# EAGLE design 6x7 (EAGLE 6.6.0)
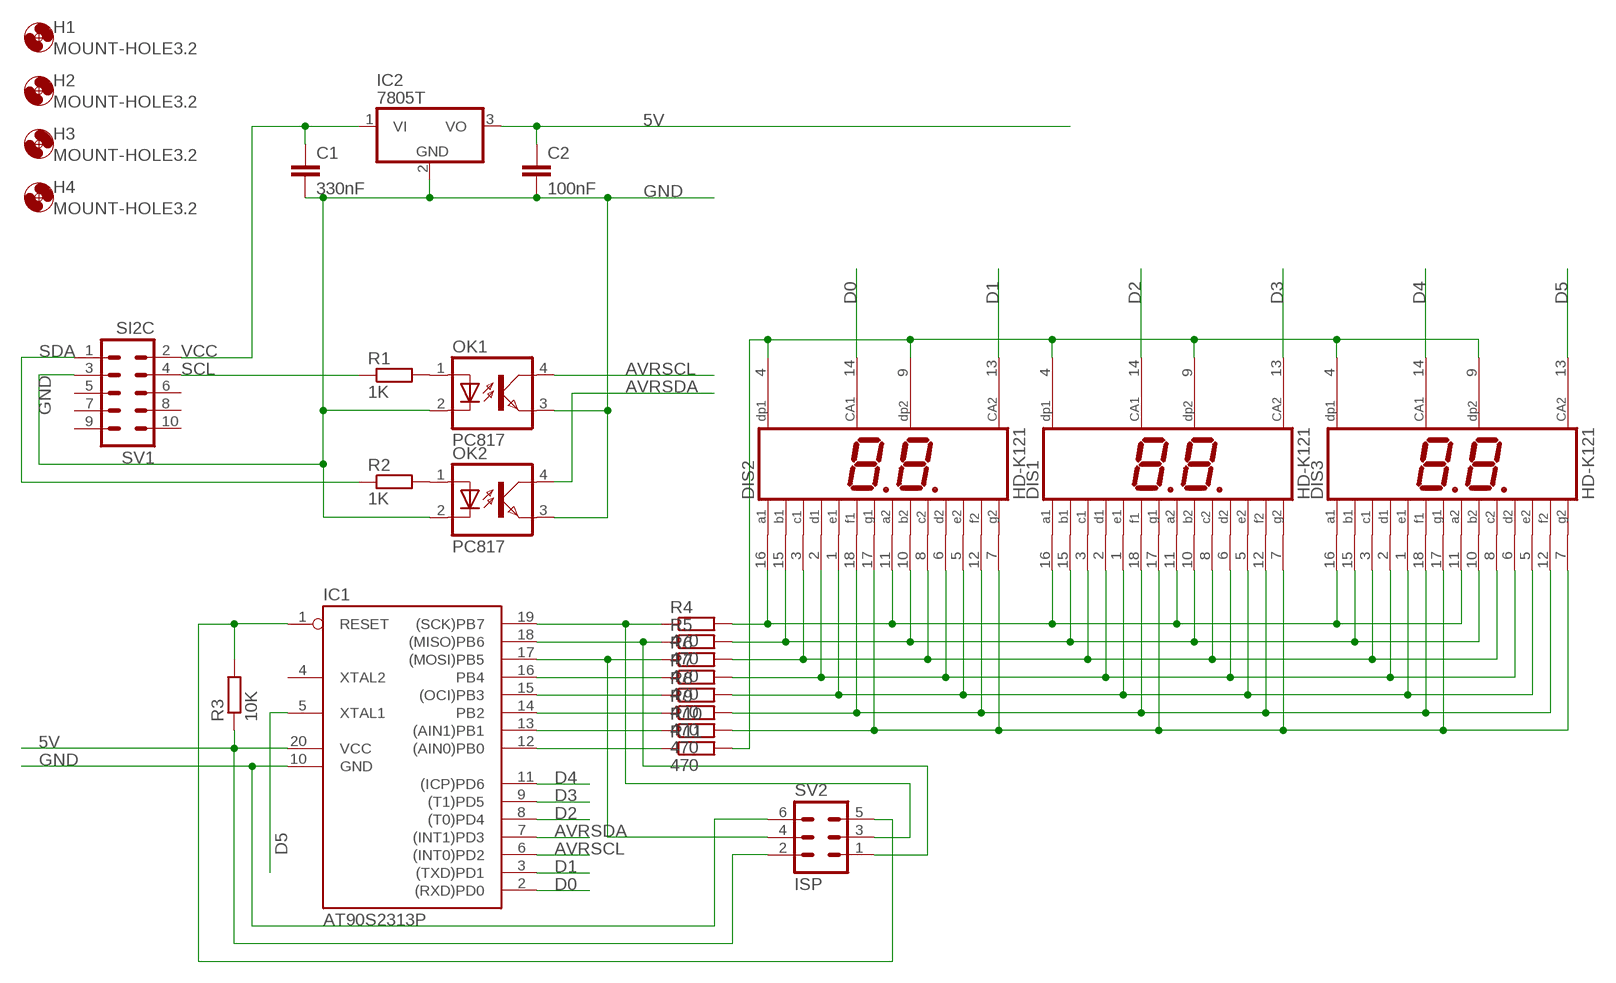
[diagram p0: schematic, sheet 1]

## Parts
C1  330nF  C2,5-3  [C2.5-3]
C2  100nF  C-EU050-024X044  [C050-024X044]
DIS1  HD-K121  [HDSP-R]
DIS2  HD-K121  [HDSP-R]
DIS3  HD-K121  [HDSP-R]
H1  MOUNT-HOLE3.2  [3,2]
H2  MOUNT-HOLE3.2  [3,2]
H3  MOUNT-HOLE3.2  [3,2]
H4  MOUNT-HOLE3.2  [3,2]
IC1  AT90S2313P  [DIL20]
IC2  7805T  [TO220H]
OK1  PC817  [DIL04]
OK2  PC817  [DIL04]
R1  1K  R-EU_0207/10  [0207/10]
R2  1K  R-EU_0207/10  [0207/10]
R3  10K  R-EU_0207/10  [0207/10]
R4  470  R-EU_0207/10  [0207/10]
R5  470  R-EU_0207/10  [0207/10]
R6  470  R-EU_0207/10  [0207/10]
R7  470  R-EU_0207/10  [0207/10]
R8  470  R-EU_0207/10  [0207/10]
R9  470  R-EU_0207/10  [0207/10]
R10  470  R-EU_0207/10  [0207/10]
R11  470  R-EU_0207/10  [0207/10]
SV1  SI2C  ML10  [ML10]
SV2  ISP  ML6  [ML6]

## Nets
5V: C2.1 IC1.20(VCC) IC2.3(VO) R3.1 SV2.2
AVRSCL: IC1.6((INT0)PD2) OK1.4(COL)
AVRSDA: IC1.7((INT1)PD3) OK2.4(COL)
D0: DIS2.14(CA1) IC1.2((RXD)PD0)
D1: DIS2.13(CA2) IC1.3((TXD)PD1)
D2: DIS1.14(CA1) IC1.8((T0)PD4)
D3: DIS1.13(CA2) IC1.9((T1)PD5)
D4: DIS3.14(CA1) IC1.11((ICP)PD6)
D5: DIS3.13(CA2) IC1.5(XTAL1)
GND: C1.2 C2.2 IC1.10(GND) IC2.2(GND) OK1.2(C) OK1.3(EMIT) OK2.2(C) OK2.3(EMIT) SV1.3 SV2.6
N$1: OK1.1(A) R1.2
N$2: IC1.19((SCK)PB7) R4.1 SV2.3
N$3: IC1.1(RESET) R3.2 SV2.5
N$4: OK2.1(A) R2.2
N$5: IC1.18((MISO)PB6) R5.1 SV2.1
N$6: DIS1.3(C1) DIS1.8(C2) DIS2.3(C1) DIS2.8(C2) DIS3.3(C1) DIS3.8(C2) R6.2
N$7: IC1.17((MOSI)PB5) R6.1 SV2.4
N$8: IC1.16(PB4) R7.1
N$9: IC1.15((OCI)PB3) R8.1
N$10: DIS1.7(G2) DIS1.17(G1) DIS2.7(G2) DIS2.17(G1) DIS3.7(G2) DIS3.17(G1) R10.2
N$11: DIS1.4(DP1) DIS1.9(DP2) DIS2.4(DP1) DIS2.9(DP2) DIS3.4(DP1) DIS3.9(DP2) R11.2
N$12: IC1.14(PB2) R9.1
N$13: IC1.13((AIN1)PB1) R10.1
N$14: IC1.12((AIN0)PB0) R11.1
N$16: DIS1.11(A2) DIS1.16(A1) DIS2.11(A2) DIS2.16(A1) DIS3.11(A2) DIS3.16(A1) R4.2
N$17: DIS1.10(B2) DIS1.15(B1) DIS2.10(B2) DIS2.15(B1) DIS3.10(B2) DIS3.15(B1) R5.2
N$19: DIS1.2(D1) DIS1.6(D2) DIS2.2(D1) DIS2.6(D2) DIS3.2(D1) DIS3.6(D2) R7.2
N$20: DIS1.1(E1) DIS1.5(E2) DIS2.1(E1) DIS2.5(E2) DIS3.1(E1) DIS3.5(E2) R8.2
N$21: DIS1.12(F2) DIS1.18(F1) DIS2.12(F2) DIS2.18(F1) DIS3.12(F2) DIS3.18(F1) R9.2
SCL: R1.1 SV1.4
SDA: R2.1 SV1.1
VCC: C1.1 IC2.1(VI) SV1.2
Unconnected: IC1.4(XTAL2) SV1.5 SV1.6 SV1.7 SV1.8 SV1.9 SV1.10

## Library data of the parts
C1 = capacitor-wima:C: CAPACITOR naming: grid - package width
C2 = rcl:C-EU: CAPACITOR, European symbol
DIS1-DIS3 = display-hp:HD-K121: LED DISPLAY 2 x 1 character 7 segment, decimal points right; OC_FARNELL: unknown; OC_NEWARK: unknown
H1-H4 = holes:MOUNT-HOLE: MOUNTING HOLE with drill center marker
IC1 = atmel:AT90S2313: MICROCONTROLLER 2 Kbytes FLASH 128 bytes SRAM 128 bytes EEPROM UART; OC_FARNELL: unknown; OC_NEWARK: unknown
IC2 = linear:78*: Positive VOLTAGE REGULATOR Source: http://cache.national.com/ds/LM/LM78L05.pdf http://www.fairchildsemi.com/ds/LM/LM7805.pdf
OK1 OK2 = optocoupler:PC817: SHARP OPTO COUPLER; MPN: PC817X4J000F; OC_FARNELL: 9707727; OC_NEWARK: 97K7059
R1-R11 = rcl:R-EU_: RESISTOR, European symbol
SV1 = con-harting-ml:ML10: HARTING; OC_FARNELL: unknown; OC_NEWARK: unknown
SV2 = con-harting-ml:ML6: HARTING; OC_FARNELL: unknown; OC_NEWARK: unknown

## Net classes
0 default: clearance 0.205 mm

## Board
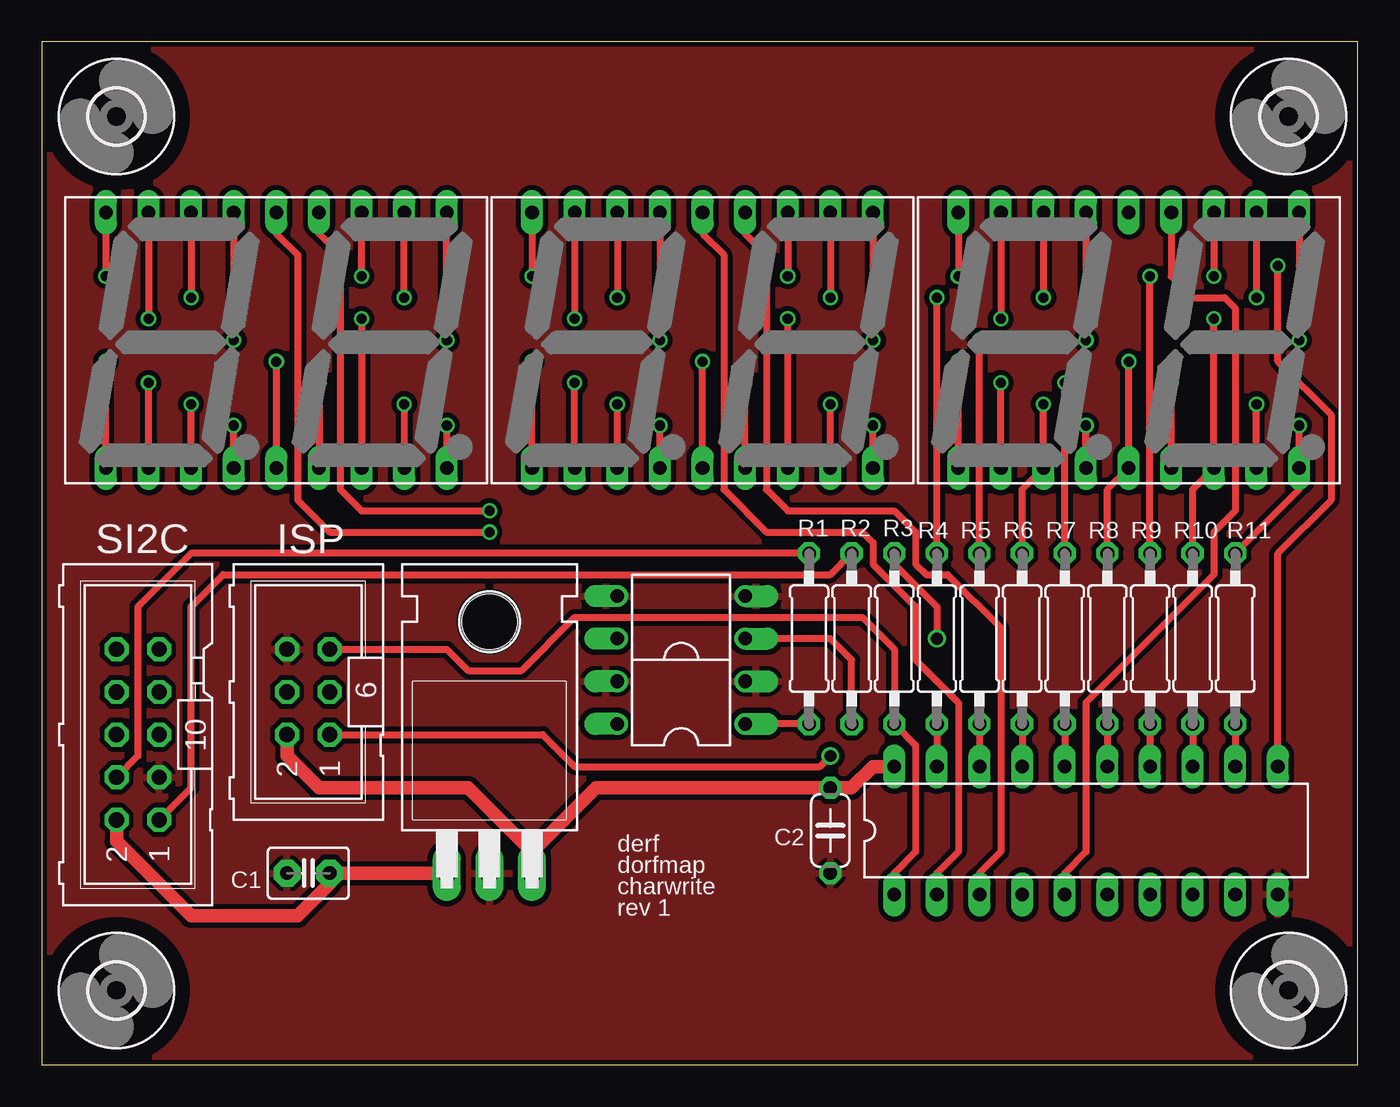
[diagram p1: board, top side]
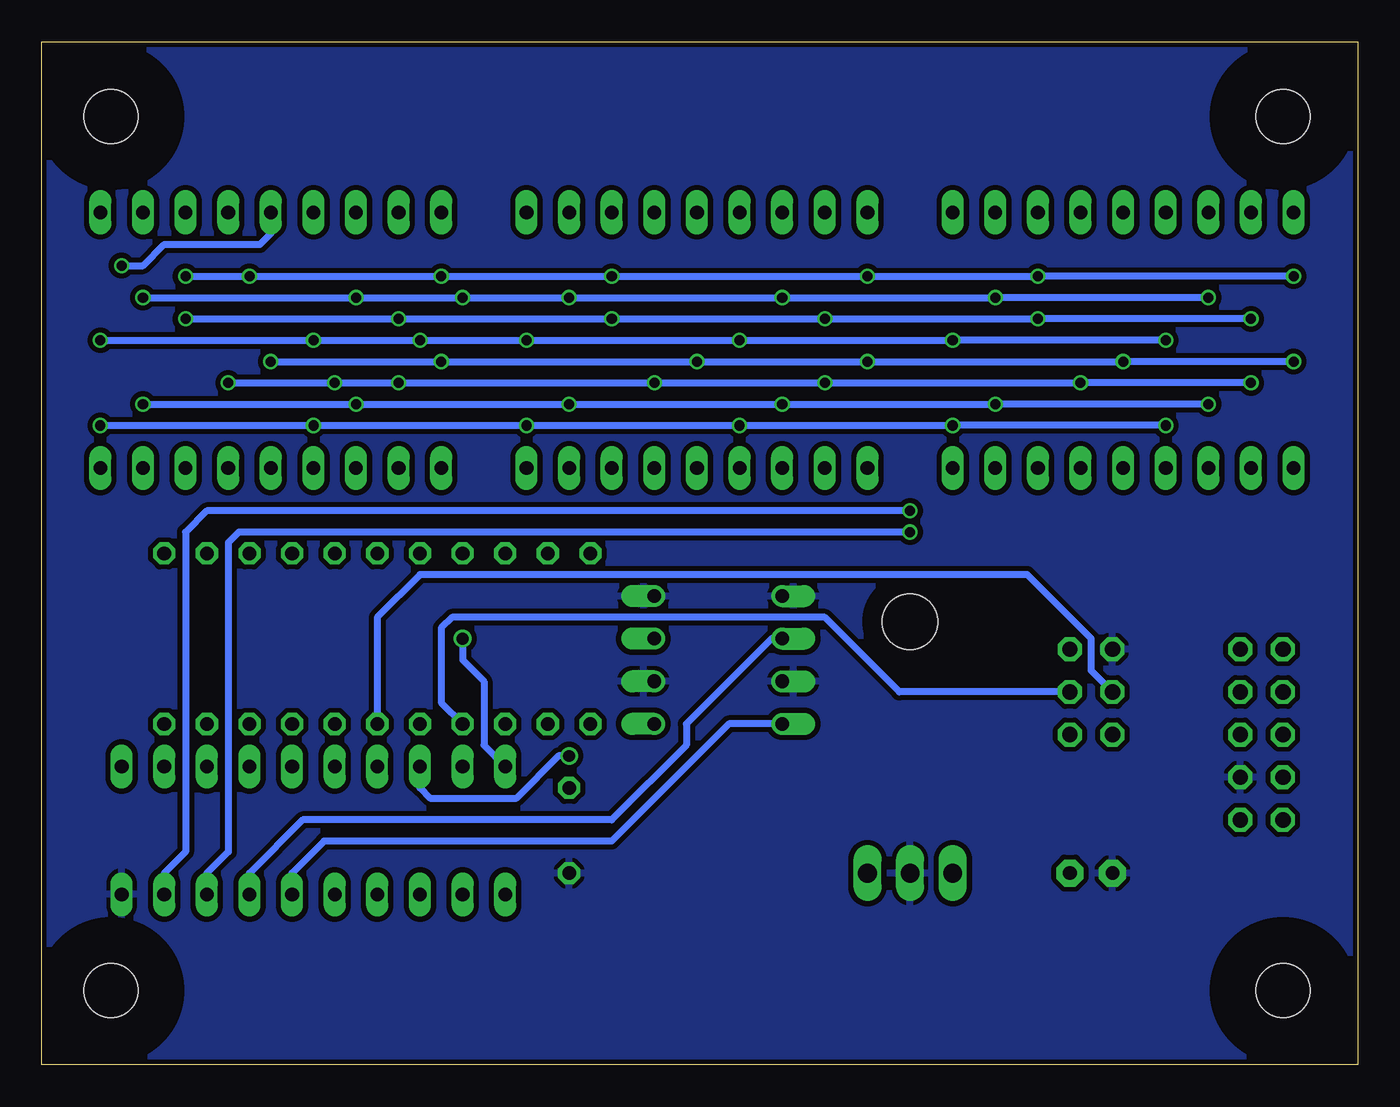
[diagram p2: board, bottom side, seen from below]

Size 78.41 x 60.95 mm. Coordinates in mm from the lower left corner, seen from the top.
Outline: 0,0 78.41,0 78.41,60.95 0,60.95 0,0
Copper layers (1*16): Top 0.035mm / dielectric 1.5mm / Bottom 0.035mm
Design rules "dirtypcbs_v1 *": minimum track width 5mil, minimum drill 12mil, track to track 5mil, track to pad 5mil, pad to pad 5mil, via to via 5mil, smd to smd 0mil, copper to edge 10mil, drill to drill 10mil, minimum pad ring 10mil, minimum via ring 6mil, stop-mask expansion 2mil, vias tented up to drill 25mil, thermal gap 10mil

### Footprints (pad centres in the part's own frame; a part is rotated, then mirrored left to right if it is on the bottom)
C2.5-3 = drill 0.813 pad 1.6 octagon: 1 -1.27,0; 2 1.27,0
C050-024X044 = drill 0.813 octagon: 1 -2.54,0; 2 2.54,0
HDSP-R = drill 0.813 long: 1 -10.16,-7.62; 2 -7.62,-7.62; 3 -5.08,-7.62; 4 -2.54,-7.62; 5 0,-7.62; 6 2.54,-7.62; 7 5.08,-7.62; 8 7.62,-7.62; 9 10.16,-7.62; 10 10.16,7.62; 11 7.62,7.62; 12 5.08,7.62; 13 2.54,7.62; 14 0,7.62; 15 -2.54,7.62; 16 -5.08,7.62; 17 -7.62,7.62; 18 -10.16,7.62
3,2 = hole 3.2: 0,0
DIL20 = drill 0.813 long: 1 -11.43,-3.81; 2 -8.89,-3.81; 3 -6.35,-3.81; 4 -3.81,-3.81; 5 -1.27,-3.81; 6 1.27,-3.81; 7 3.81,-3.81; 8 6.35,-3.81; 9 8.89,-3.81; 10 11.43,-3.81; 11 11.43,3.81; 12 8.89,3.81; 13 6.35,3.81; 14 3.81,3.81; 15 1.27,3.81; 16 -1.27,3.81; 17 -3.81,3.81; 18 -6.35,3.81; 19 -8.89,3.81; 20 -11.43,3.81
TO220H = drill 1.118 long: 1 -2.54,-10.16; 2 0,-10.16; 3 2.54,-10.16 | hole 3.302: 0,4.826
DIL04 = drill 0.813 offset: 1 -1.27,-3.81; 2 1.27,-3.81; 3 1.27,3.81; 4 -1.27,3.81
0207/10 = drill 0.813 octagon: 1 -5.08,0; 2 5.08,0
ML10 = drill 0.914 octagon: 1 -5.08,-1.27; 2 -5.08,1.27; 3 -2.54,-1.27; 4 -2.54,1.27; 5 0,-1.27; 6 0,1.27; 7 2.54,-1.27; 8 2.54,1.27; 9 5.08,-1.27; 10 5.08,1.27
ML6 = drill 0.914 octagon: 1 -2.54,-1.27; 2 -2.54,1.27; 3 0,-1.27; 4 0,1.27; 5 2.54,-1.27; 6 2.54,1.27

### Placement (x,y rotation side)
C1  15.88,11.43 180 top
C2  46.99,13.97 270 top
DIS1  13.97,43.18 0 top
DIS2  39.37,43.18 0 top
DIS3  64.77,43.18 0 top
H1  4.45,4.45 0 top
H2  74.3,4.45 0 top
H3  4.45,56.52 0 top
H4  74.3,56.52 0 top
IC1  62.23,13.97 0 top
IC2  26.67,21.59 0 top
OK1  38.1,21.59 90 top
OK2  38.1,26.67 90 top
R1  45.72,25.4 270 top
R2  48.26,25.4 270 top
R3  50.8,25.4 270 top
R4  53.34,25.4 90 top
R5  55.88,25.4 90 top
R6  58.42,25.4 90 top
R7  60.96,25.4 90 top
R8  63.5,25.4 90 top
R9  66.04,25.4 90 top
R10  68.58,25.4 90 top
R11  71.12,25.4 90 top
SV1  5.71,19.68 90 top
SV2  15.88,22.23 90 top

### Tracks (layer width: path | path; a pad name or v marks a point on that pad's centre or on a via)
5V  (via drill 0.7)
  Top 0.406: R3.1 50.8,29.84 53.34,27.3 v53.34,25.4
  Top 0.813: SV2.2 14.61,18.41 16.51,16.51 25.4,16.51 29.21,12.7 | 29.21,12.7 IC2.3 | 29.21,12.7 33.02,16.51 C2.1 48.26,16.51 49.53,17.78 IC1.20
  Bottom 0.406: v53.34,25.4 53.34,24.13 52.07,22.86 52.07,19.05 IC1.20
AVRSCL
  Bottom 0.406: OK1.4 37.47,20.32 44.45,13.34 61.59,13.34 63.5,11.43 IC1.6
AVRSDA
  Bottom 0.406: OK2.4 34.92,25.4 40.01,20.32 40.01,19.05 44.45,14.61 62.87,14.61 66.04,11.43 IC1.7
D0
  Top 0.406: DIS2.14 39.37,49.53 40.64,48.26 40.64,34.29 43.18,31.75 48.9,31.75 49.53,31.11 49.53,29.84 52.07,27.3 52.07,24.13 54.61,21.59 54.61,12.7 53.34,11.43 IC1.2
D1
  Top 0.406: DIS2.13 41.91,49.53 43.18,48.26 43.18,34.29 44.45,33.02 50.8,33.02 52.07,31.75 52.07,29.84 52.7,29.21 53.98,29.21 57.15,26.04 57.15,12.7 55.88,11.43 IC1.3
D2  (via drill 0.6)
  Top 0.406: DIS1.14 13.97,49.53 15.24,48.26 15.24,33.66 17.14,31.75 v26.67,31.75
  Bottom 0.406: v26.67,31.75 66.67,31.75 67.31,31.11 67.31,12.7 68.58,11.43 IC1.8
D3  (via drill 0.6)
  Top 0.406: DIS1.13 16.51,49.53 17.78,48.26 17.78,34.29 19.05,33.02 v26.67,33.02
  Bottom 0.406: v26.67,33.02 68.58,33.02 69.85,31.75 69.85,12.7 71.12,11.43 IC1.9
D4  (via drill 0.6)
  Top 0.406: IC1.11 73.66,30.48 76.83,33.66 76.83,38.73 73.66,41.91 v73.66,47.62
  Bottom 0.406: v73.66,47.62 72.39,47.62 71.12,48.9 65.41,48.9 64.77,49.53 DIS3.14
D5
  Top 0.406: DIS3.13 67.31,46.99 68.58,45.72 70.48,45.72 71.12,45.09 71.12,33.02 69.85,31.75 69.85,29.21 62.23,21.59 62.23,12.7 60.96,11.43 IC1.5
GND
  pour Top (isolate 0.305): 0,60.96 78.74,60.96 78.74,0 0,0
  pour Bottom (isolate 0.305): 0,0 0,60.96 78.74,60.96 78.74,0
N$1
  Top 0.406: R1.2 OK1.1
N$2
  Top 0.406: R4.1 IC1.19
  Bottom 0.406: SV2.3 27.3,22.23 31.75,26.67 53.98,26.67 54.61,26.04 54.61,21.59 R4.1
N$3
  Top 0.406: SV2.5 24.13,24.77 25.4,23.5 28.57,23.5 31.75,26.67 48.9,26.67 50.8,24.77 R3.2 52.07,19.05 52.07,12.7 50.8,11.43 IC1.1
N$4
  Top 0.406: R2.2 48.26,24.13 46.99,25.4 OK2.1
N$5  (via drill 0.7)
  Top 0.406: R5.1 IC1.18 | SV2.1 29.84,19.68 31.75,17.78 46.35,17.78 v46.99,18.41
  Bottom 0.406: v46.99,18.41 47.62,18.41 50.16,15.88 55.24,15.88 55.88,16.51 IC1.18
N$6  (via drill 0.6)
  Top 0.406: DIS1.3 v8.89,39.37 | v21.59,39.37 DIS1.8 | DIS2.3 v34.29,39.37 | DIS2.8 v46.99,39.37 | DIS3.8 v72.39,39.37 | v59.69,39.37 DIS3.3 58.42,34.29 R6.2
  Bottom 0.406: v8.89,39.37 v21.59,39.37 v34.29,39.37 v46.99,39.37 v59.69,39.37 v72.39,39.37
N$7
  Top 0.406: R6.1 IC1.17
  Bottom 0.406: SV2.4 15.88,23.5 15.88,25.4 19.68,29.21 55.88,29.21 58.42,26.67 R6.1
N$8
  Top 0.406: R7.1 IC1.16
N$9
  Top 0.406: R8.1 IC1.15
N$10  (via drill 0.6)
  Top 0.406: DIS1.17 v6.35,44.45 | v19.05,44.45 DIS1.7 | DIS2.17 v31.75,44.45 | DIS3.17 v57.15,44.45 | DIS2.7 v44.45,44.45 | v69.85,44.45 DIS3.7 68.58,34.29 R10.2
  Bottom 0.406: v6.35,44.45 v19.05,44.45 v31.75,44.45 v44.45,44.45 v57.15,44.45 v69.85,44.45
N$11  (via drill 0.6)
  Top 0.406: DIS1.4 v11.43,38.1 | v24.13,38.1 DIS1.9 | DIS2.4 v36.83,38.1 | DIS2.9 v49.53,38.1 | DIS3.4 v62.23,38.1 | v74.93,38.1 DIS3.9 74.93,34.29 R11.2
  Bottom 0.406: v11.43,38.1 v24.13,38.1 v36.83,38.1 v49.53,38.1 v62.23,38.1 v74.93,38.1
N$12
  Top 0.406: R9.1 IC1.14
N$13
  Top 0.406: R10.1 IC1.13
N$14
  Top 0.406: R11.1 IC1.12
N$16  (via drill 0.6)
  Top 0.406: DIS1.16 v8.89,45.72 | v21.59,45.72 DIS1.11 | DIS2.16 v34.29,45.72 | DIS2.11 v46.99,45.72 | DIS3.16 v59.69,45.72 | DIS3.11 v72.39,45.72 | R4.2 v53.34,45.72
  Bottom 0.406: v8.89,45.72 v21.59,45.72 v34.29,45.72 v46.99,45.72 v53.34,45.72 v59.69,45.72 v72.39,45.72
N$17  (via drill 0.6)
  Top 0.406: DIS1.15 v11.43,43.18 | v24.13,43.18 DIS1.10 | DIS2.15 v36.83,43.18 | DIS2.10 v49.53,43.18 | DIS3.15 v62.23,43.18 | DIS3.10 v74.93,43.18 | R5.2 v55.88,43.18
  Bottom 0.406: v11.43,43.18 v24.13,43.18 v36.83,43.18 v49.53,43.18 v55.88,43.18 v62.23,43.18 v74.93,43.18
N$19  (via drill 0.6)
  Top 0.406: DIS1.2 v6.35,40.64 | v16.51,40.64 DIS1.6 | DIS2.2 v31.75,40.64 | DIS2.6 v41.91,40.64 | DIS3.2 v57.15,40.64 | DIS3.6 v67.31,40.64 | R7.2 v60.96,40.64
  Bottom 0.406: v6.35,40.64 v16.51,40.64 v31.75,40.64 v41.91,40.64 v57.15,40.64 v60.96,40.64 v67.31,40.64
N$20  (via drill 0.6)
  Top 0.406: DIS1.1 v3.81,41.91 | v13.97,41.91 DIS1.5 | DIS2.1 v29.21,41.91 | DIS2.5 v39.37,41.91 | DIS3.1 v54.61,41.91 | v64.77,41.91 DIS3.5 63.5,34.29 R8.2
  Bottom 0.406: v3.81,41.91 v13.97,41.91 v29.21,41.91 v39.37,41.91 v54.61,41.91 v64.77,41.91
N$21  (via drill 0.6)
  Top 0.406: DIS1.18 v3.81,46.99 | v19.05,46.99 DIS1.12 | DIS2.18 v29.21,46.99 | DIS3.12 v69.85,46.99 | DIS2.12 v44.45,46.99 | DIS3.18 v54.61,46.99 | R9.2 v66.04,46.99
  Bottom 0.406: v3.81,46.99 v19.05,46.99 v29.21,46.99 v44.45,46.99 v54.61,46.99 v66.04,46.99 v69.85,46.99
SCL
  Top 0.406: R1.1 8.89,30.48 5.71,27.3 5.71,18.41 SV1.4
SDA
  Top 0.406: SV1.1 8.89,16.51 8.89,27.3 10.79,29.21 46.99,29.21 R2.1
VCC
  Top 0.813: SV1.2 4.45,13.34 8.89,8.89 15.24,8.89 17.14,10.79 C1.1 IC2.1

### Text on the board
tNames: SI2C | ISP | derf | dorfmap | charwrite | rev 1